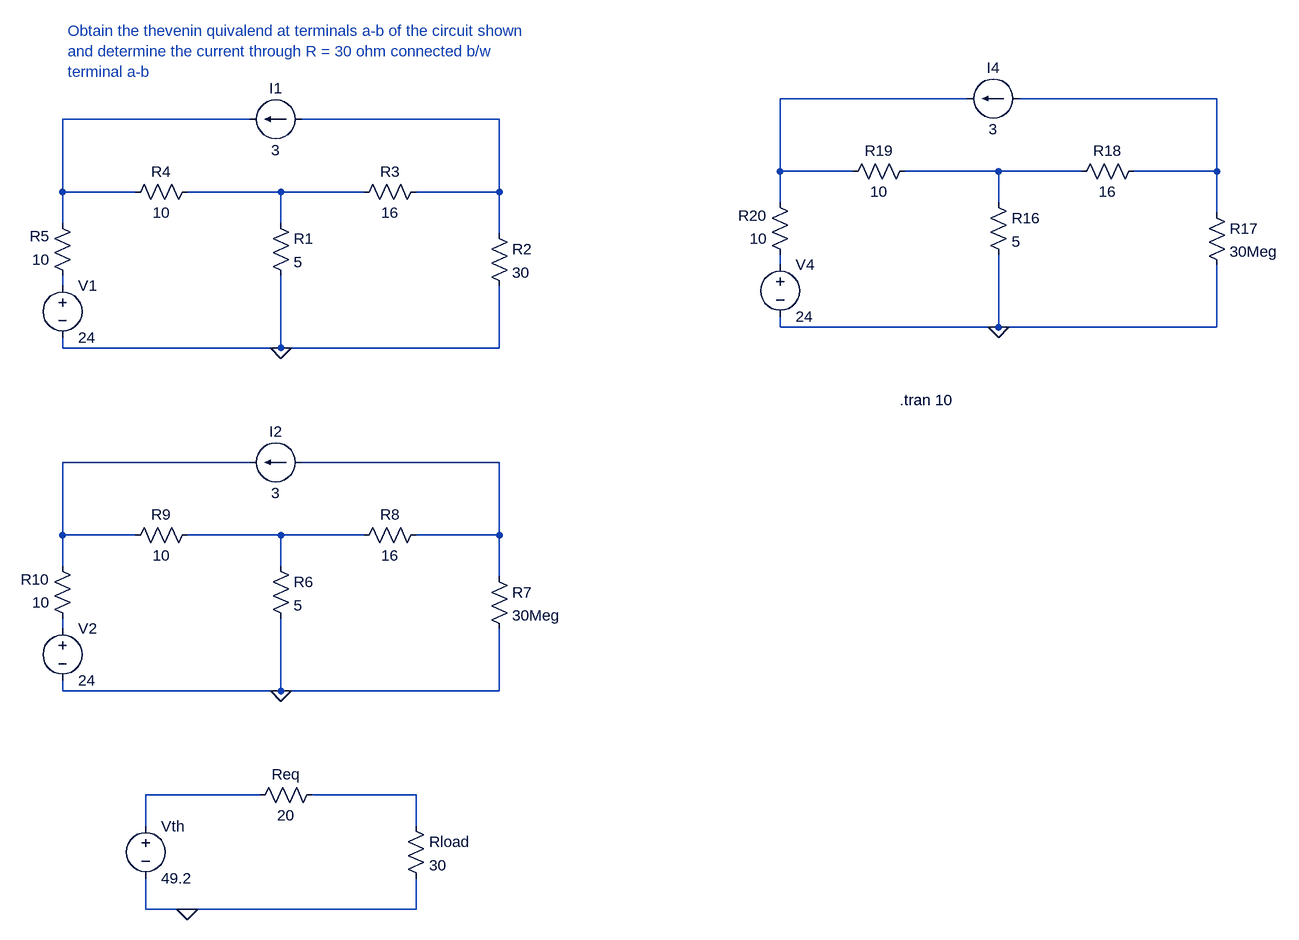
[diagram p0: schematic Lab2_ques4.asc]
Lab2_ques4.asc, the LTspice schematic file:
Version 4
SHEET 1 1840 1440
WIRE 1360 176 1072 176
WIRE 1744 176 1440 176
WIRE 256 208 -32 208
WIRE 640 208 336 208
WIRE 1072 288 1072 176
WIRE 1184 288 1072 288
WIRE 1408 288 1264 288
WIRE 1536 288 1408 288
WIRE 1744 288 1744 176
WIRE 1744 288 1616 288
WIRE -32 320 -32 208
WIRE 80 320 -32 320
WIRE 304 320 160 320
WIRE 432 320 304 320
WIRE 640 320 640 208
WIRE 640 320 512 320
WIRE 1072 336 1072 288
WIRE 1408 336 1408 288
WIRE 1744 352 1744 288
WIRE -32 368 -32 320
WIRE 304 368 304 320
WIRE 640 384 640 320
WIRE 1072 432 1072 416
WIRE -32 464 -32 448
WIRE 1072 528 1072 512
WIRE 1408 528 1408 416
WIRE 1408 528 1072 528
WIRE 1744 528 1744 432
WIRE 1744 528 1408 528
WIRE -32 560 -32 544
WIRE 304 560 304 448
WIRE 304 560 -32 560
WIRE 640 560 640 464
WIRE 640 560 304 560
WIRE 256 736 -32 736
WIRE 640 736 336 736
WIRE -32 848 -32 736
WIRE 80 848 -32 848
WIRE 304 848 160 848
WIRE 432 848 304 848
WIRE 640 848 640 736
WIRE 640 848 512 848
WIRE -32 896 -32 848
WIRE 304 896 304 848
WIRE 640 912 640 848
WIRE -32 992 -32 976
WIRE -32 1088 -32 1072
WIRE 304 1088 304 976
WIRE 304 1088 -32 1088
WIRE 640 1088 640 992
WIRE 640 1088 304 1088
WIRE 272 1248 96 1248
WIRE 512 1248 352 1248
WIRE 96 1296 96 1248
WIRE 512 1296 512 1248
WIRE 96 1424 96 1376
WIRE 160 1424 96 1424
WIRE 512 1424 512 1376
WIRE 512 1424 160 1424
FLAG 1408 528 0
FLAG 304 560 0
FLAG 304 1088 0
FLAG 160 1424 0
SYMBOL Res 1392 320 R0
SYMATTR InstName R16
SYMATTR Value 5
SYMBOL Res 1728 336 R0
SYMATTR InstName R17
SYMATTR Value 30Meg
SYMBOL Res 1632 272 R90
WINDOW 0 0 56 VBottom 2
WINDOW 3 32 56 VTop 2
SYMATTR InstName R18
SYMATTR Value 16
SYMBOL Res 1280 272 R90
WINDOW 0 0 56 VBottom 2
WINDOW 3 32 56 VTop 2
SYMATTR InstName R19
SYMATTR Value 10
SYMBOL Res 1088 432 R180
WINDOW 0 36 76 Left 2
WINDOW 3 36 40 Left 2
SYMATTR InstName R20
SYMATTR Value 10
SYMBOL Voltage 1072 416 R0
SYMATTR InstName V4
SYMATTR Value 24
SYMBOL current 1440 176 R90
WINDOW 0 -32 40 VBottom 2
WINDOW 3 32 40 VTop 2
SYMATTR InstName I4
SYMATTR Value 3
SYMBOL Res 288 352 R0
SYMATTR InstName R1
SYMATTR Value 5
SYMBOL Res 624 368 R0
SYMATTR InstName R2
SYMATTR Value 30
SYMBOL Res 528 304 R90
WINDOW 0 0 56 VBottom 2
WINDOW 3 32 56 VTop 2
SYMATTR InstName R3
SYMATTR Value 16
SYMBOL Res 176 304 R90
WINDOW 0 0 56 VBottom 2
WINDOW 3 32 56 VTop 2
SYMATTR InstName R4
SYMATTR Value 10
SYMBOL Res -16 464 R180
WINDOW 0 36 76 Left 2
WINDOW 3 36 40 Left 2
SYMATTR InstName R5
SYMATTR Value 10
SYMBOL Voltage -32 448 R0
SYMATTR InstName V1
SYMATTR Value 24
SYMBOL current 336 208 R90
WINDOW 0 -32 40 VBottom 2
WINDOW 3 32 40 VTop 2
SYMATTR InstName I1
SYMATTR Value 3
SYMBOL Res 288 880 R0
SYMATTR InstName R6
SYMATTR Value 5
SYMBOL Res 624 896 R0
SYMATTR InstName R7
SYMATTR Value 30Meg
SYMBOL Res 528 832 R90
WINDOW 0 0 56 VBottom 2
WINDOW 3 32 56 VTop 2
SYMATTR InstName R8
SYMATTR Value 16
SYMBOL Res 176 832 R90
WINDOW 0 0 56 VBottom 2
WINDOW 3 32 56 VTop 2
SYMATTR InstName R9
SYMATTR Value 10
SYMBOL Res -16 992 R180
WINDOW 0 36 76 Left 2
WINDOW 3 36 40 Left 2
SYMATTR InstName R10
SYMATTR Value 10
SYMBOL Voltage -32 976 R0
SYMATTR InstName V2
SYMATTR Value 24
SYMBOL current 336 736 R90
WINDOW 0 -32 40 VBottom 2
WINDOW 3 32 40 VTop 2
SYMATTR InstName I2
SYMATTR Value 3
SYMBOL Voltage 96 1280 R0
SYMATTR InstName Vth
SYMATTR Value 49.2
SYMBOL Res 496 1280 R0
SYMATTR InstName Rload
SYMATTR Value 30
SYMBOL Res 368 1232 R90
WINDOW 0 0 56 VBottom 2
WINDOW 3 32 56 VTop 2
SYMATTR InstName Req
SYMATTR Value 20
TEXT -24 72 Left 2 ;Obtain the thevenin quivalend at terminals a-b of the circuit shown \nand determine the current through R = 30 ohm connected b/w\nterminal a-b
TEXT 1256 640 Left 2 !.tran 10

The netlist it stands for:
* Lab2_ques4.asc
R16 N005 0 5
R17 N002 0 30Meg
R18 N002 N005 16
R19 N005 N001 10
R20 N007 N001 10
V4 N007 0 24
I4 N002 N001 3
R1 N006 0 5
R2 N004 0 30
R3 N004 N006 16
R4 N006 N003 10
R5 N008 N003 10
V1 N008 0 24
I1 N004 N003 3
R6 N011 0 5
R7 N010 0 30Meg
R8 N010 N011 16
R9 N011 N009 10
R10 N012 N009 10
V2 N012 0 24
I2 N010 N009 3
Vth N013 0 49.2
Rload N014 0 30
Req N014 N013 20
* Obtain the thevenin quivalend at terminals a-b of the circuit shown
* and determine the current through R = 30 ohm connected b/w
* terminal a-b
.tran 10
.backanno
.end